# EAGLE board BFMC_Powerboard v0.2 (EAGLE 9.6.2), part 1 of 2
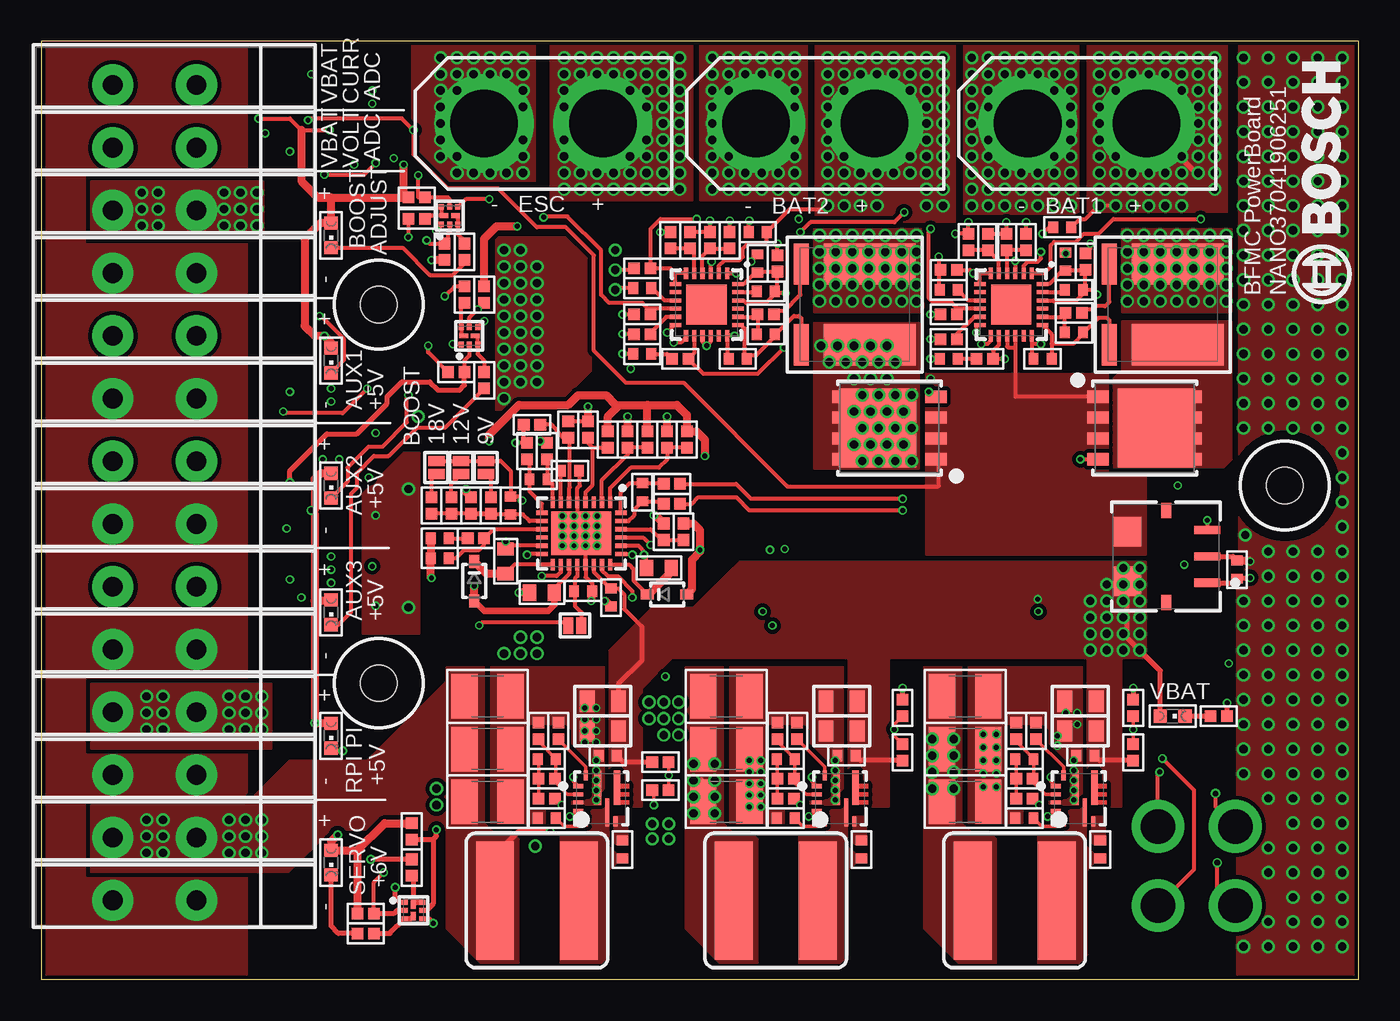
[diagram p3: board, top side]
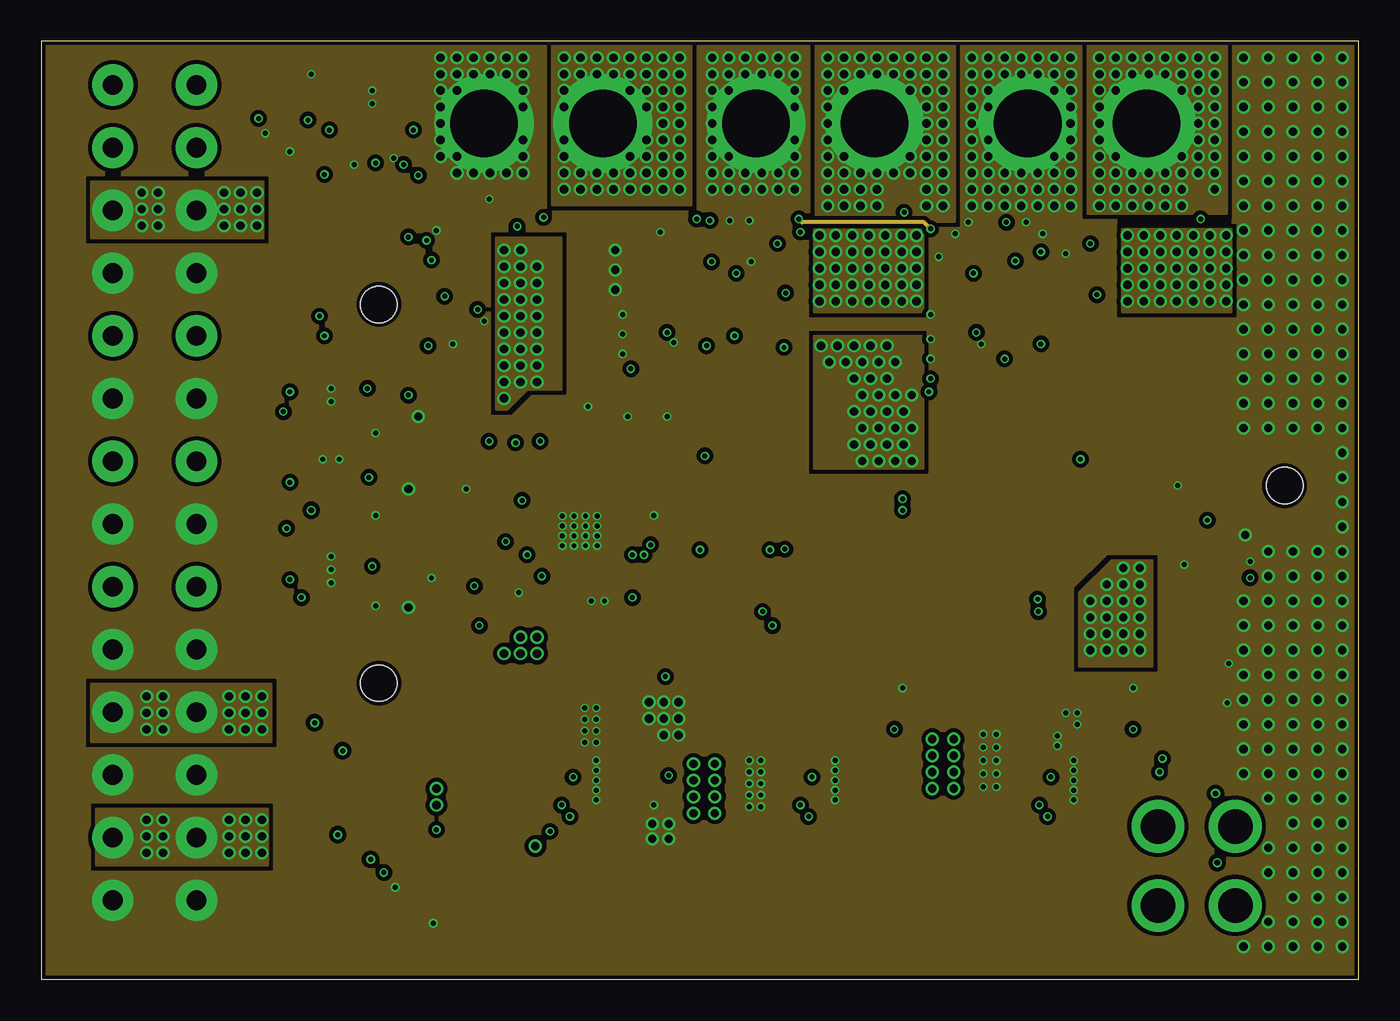
[diagram p4: board, inner layer Route2]
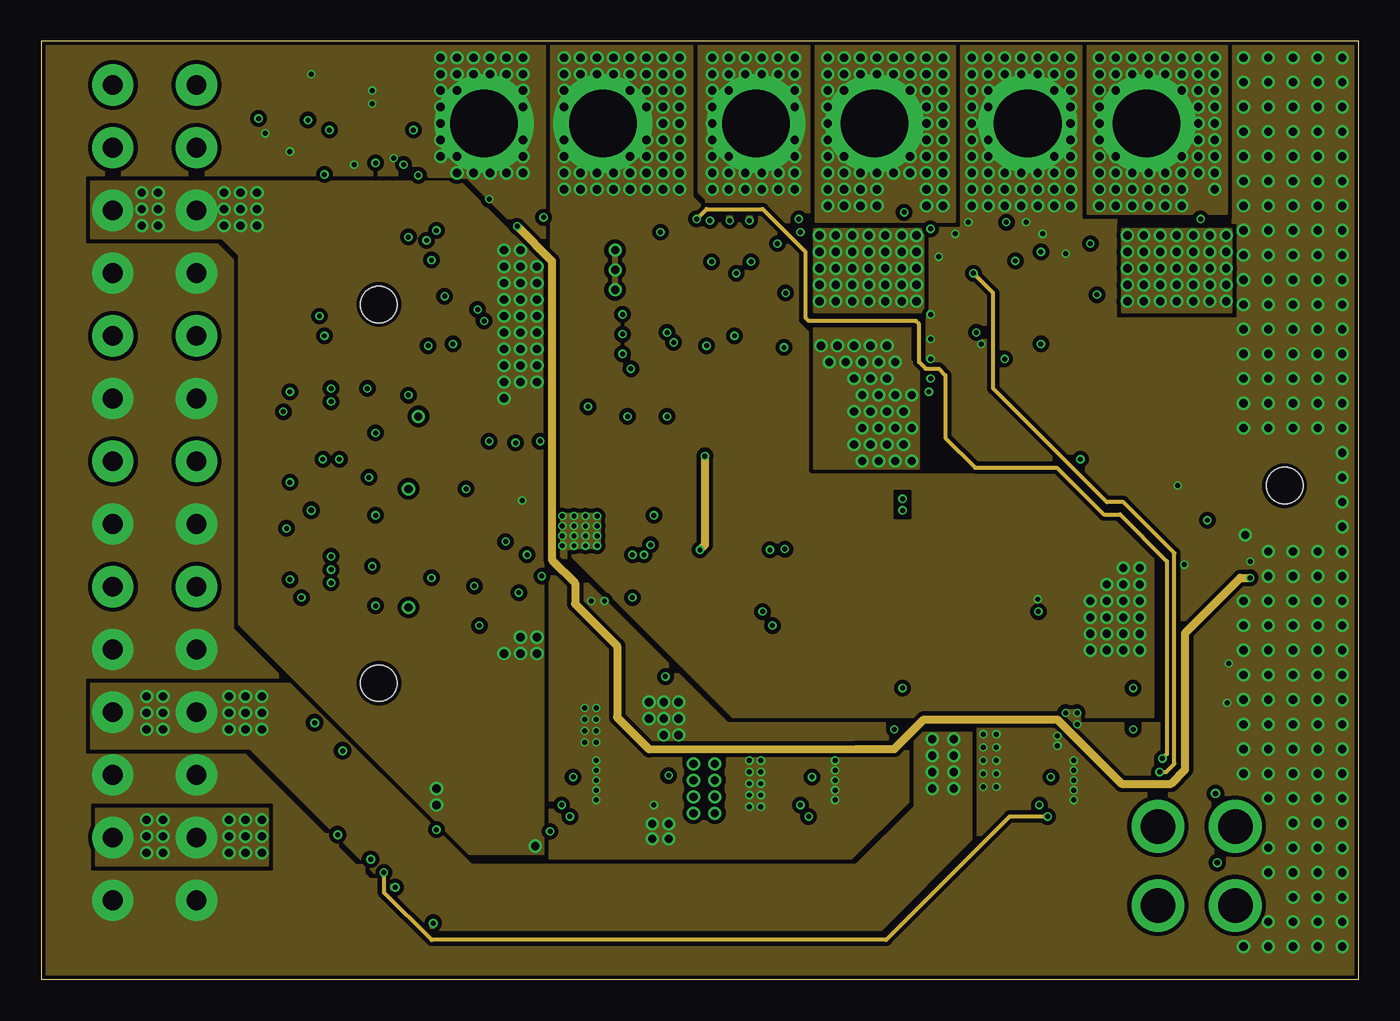
[diagram p5: board, inner layer Route3]
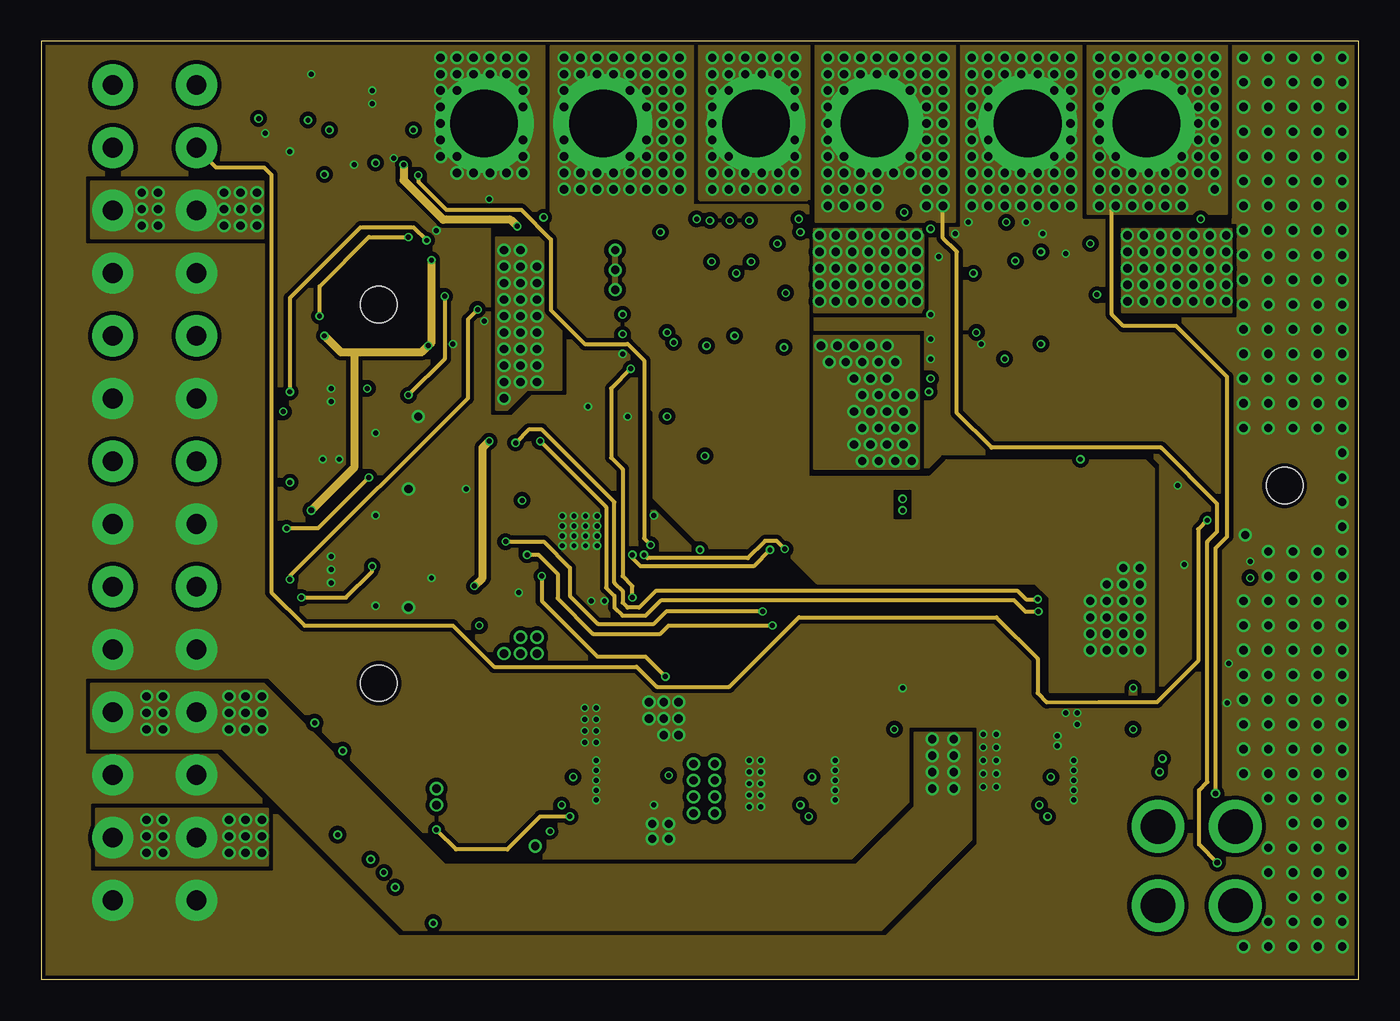
[diagram p6: board, inner layer Route14]
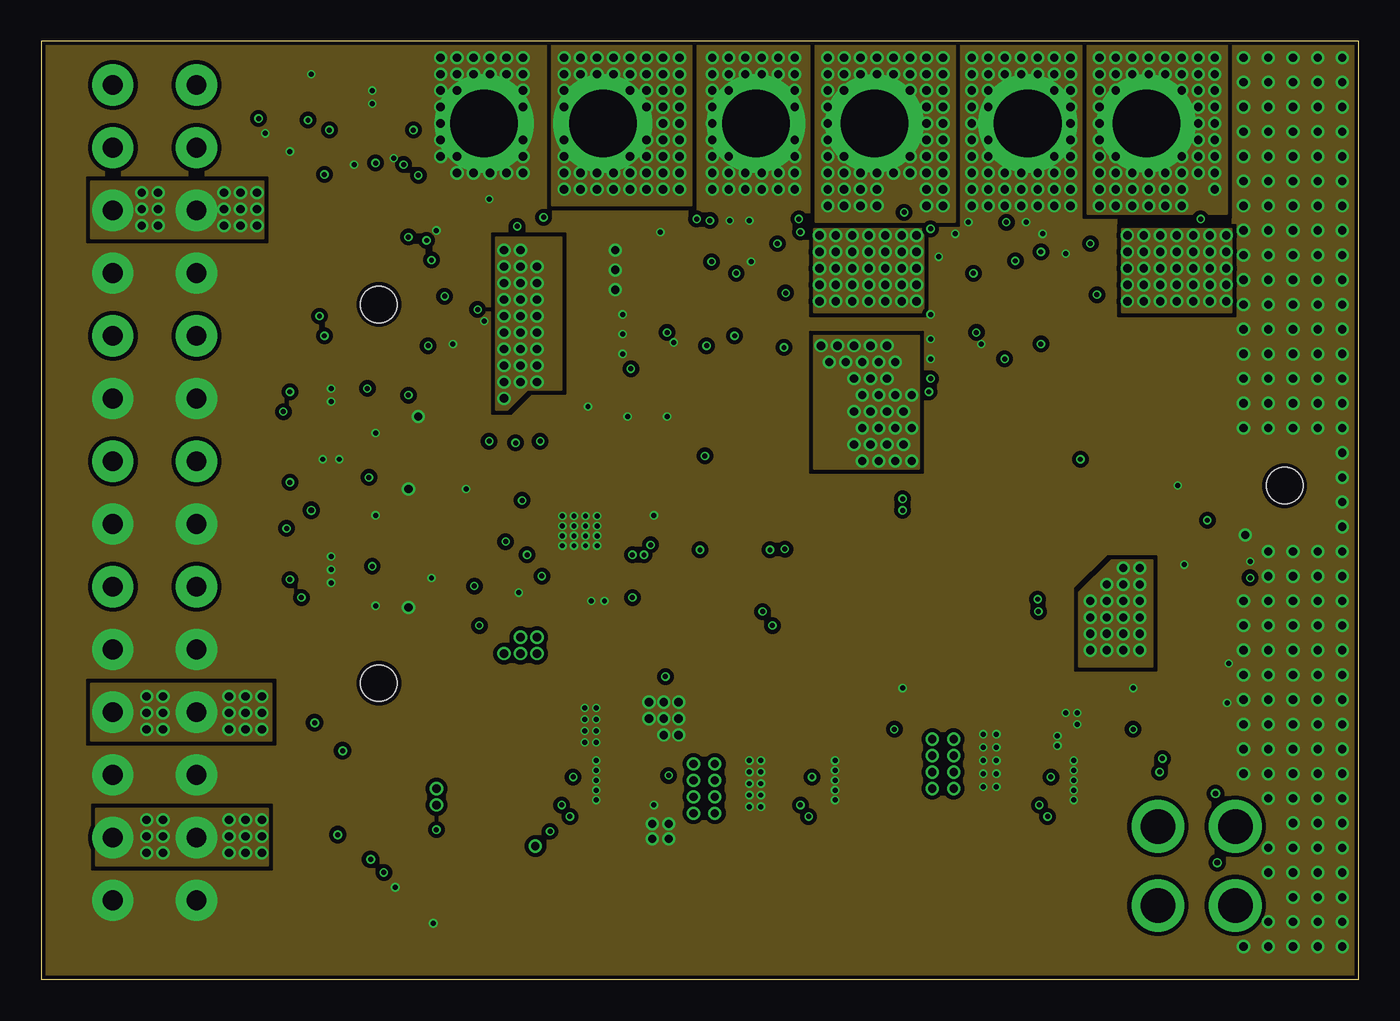
[diagram p7: board, inner layer Route15]
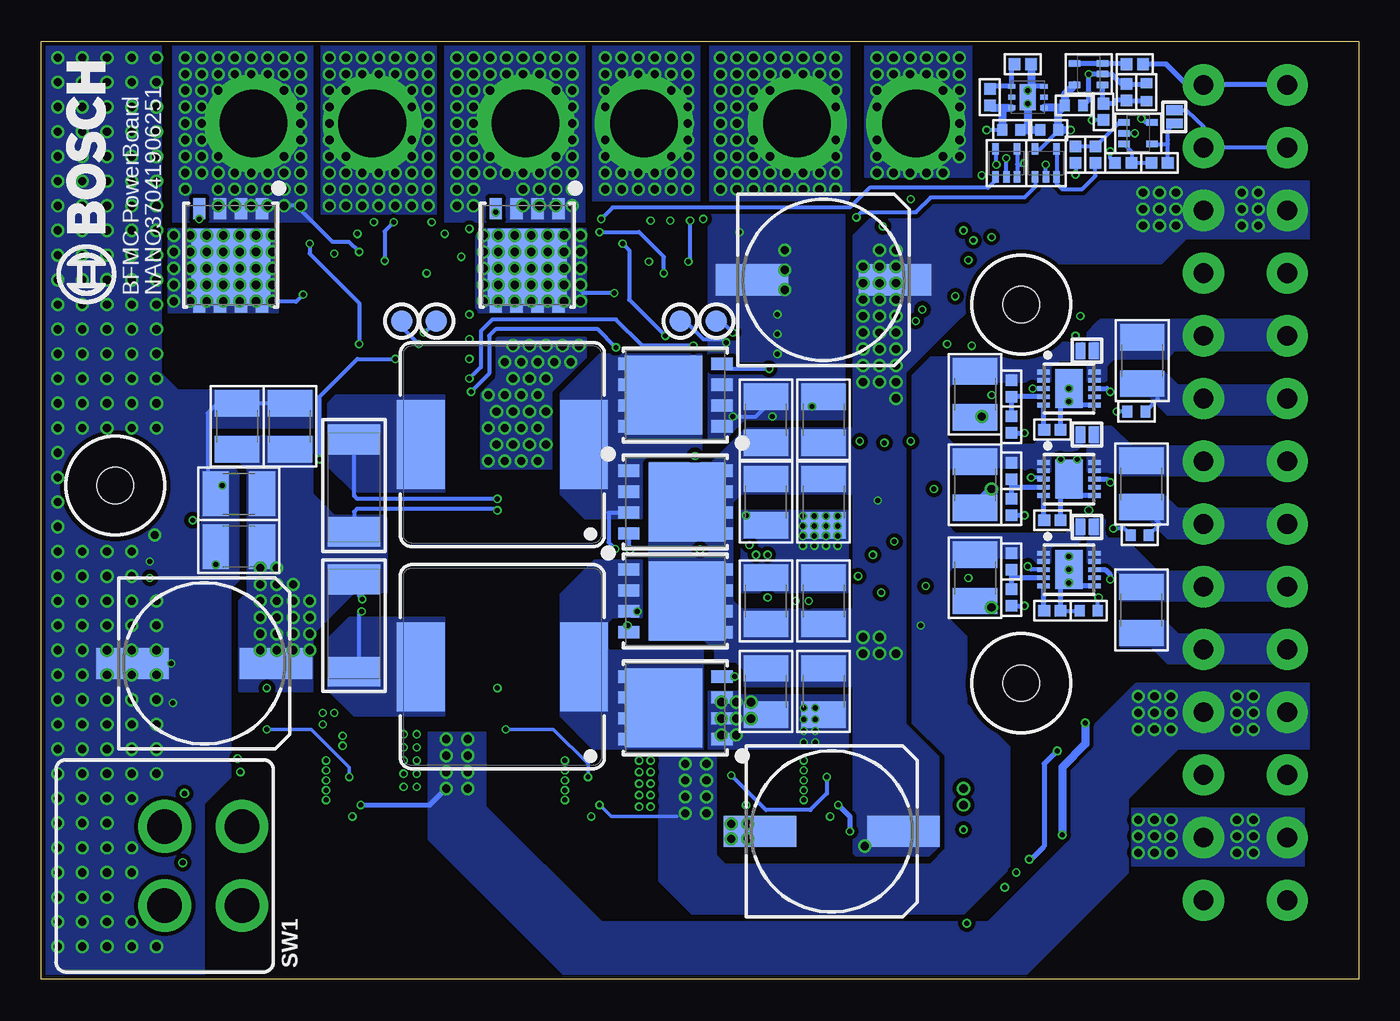
[diagram p8: board, bottom side, seen from below]

Size 80 x 57 mm. Coordinates in mm from the lower left corner, seen from the top.
Outline: 0,0 80,0 80,57 0,57 0,0
Copper layers (1+2*3+14*15+16): Top 0.018mm / dielectric 0.2mm / Route2 0.035mm / dielectric 0.36mm / Route3 0.035mm / dielectric 0.3mm / Route14 0.035mm / dielectric 0.15mm / Route15 0.035mm / dielectric 0.2mm / Bottom 0.018mm
Design rules "Multi-CB_6L_100µm-Tracks_OL35µm-IL35µm *": minimum track width 0.1mm, minimum drill 0.2mm, track to track 0.1mm, track to pad 0.1mm, pad to pad 0.1mm, via to via 0.1mm, smd to smd 0mil, copper to edge 0.2mm, drill to drill 0.2mm, minimum pad ring 0.125mm, minimum via ring 0.1mm, stop-mask expansion 2mil, vias tented up to drill 0.5mm, thermal gap 0.2mm
Holes 2.2 mm at 20.5,41 20.5,18 75.5,30
tRestrict: area 72.5,27 to 78.5,33
bRestrict: area 72.5,27 to 78.5,33; area 17.5,38 to 23.5,44; area 17.5,15 to 23.5,21

## Footprints (pad centres in the part's own frame; a part is rotated, then mirrored left to right if it is on the bottom)
C1210 = smd 1.6 x 2.7: 1 -1.4,0; 2 1.4,0
CAP_POL_1010 = smd 4.4 x 1.9: 1 -4.35,0; 2 4.35,0
C0603 = smd 0.8 x 1: 1 -0.75,0; 2 0.75,0
C0402_IPC = smd 0.6 x 0.7: 1 -0.55,0; 2 0.55,0
C0805 = smd 0.9 x 1.3: 1 -0.95,0; 2 0.95,0
SOD323-R = smd 0.8 x 0.6: A 1.2,0; C -1.2,0
DFN10-3X3 = smd 0.3 x 0.85: 1 -1,-1.55; 2 -0.5,-1.55; 3 0,-1.55; 4 0.5,-1.55; 5 1,-1.55; 6 1,1.55; 7 0.5,1.55; 8 0,1.55; 9 -0.5,1.55; 10 -1,1.55 | smd 2.38 x 1.65: EP 0,0
UFD-QFN28-4X5MM = smd 0.25 x 0.7: 1 -1.75,-1.9; 2 -1.25,-1.9; 3 -0.75,-1.9; 4 -0.25,-1.9; 5 0.25,-1.9; 6 0.75,-1.9; 7 1.25,-1.9; 8 1.75,-1.9; 15 1.75,1.9; 16 1.25,1.9; 17 0.75,1.9; 18 0.25,1.9; 19 -0.25,1.9; 20 -0.75,1.9; 21 -1.25,1.9; 22 -1.75,1.9 | smd 0.7 x 0.25: 9 2.4,-1.25; 10 2.4,-0.75; 11 2.4,-0.25; 12 2.4,0.25; 13 2.4,0.75; 14 2.4,1.25; 23 -2.4,1.25; 24 -2.4,0.75; 25 -2.4,0.25; 26 -2.4,-0.25; 27 -2.4,-0.75; 28 -2.4,-1.25 | smd 3.65 x 2.65: PAD 0,0
QFN24-4X4 = smd 0.7 x 0.25: 1 -1.9,1.25; 2 -1.9,0.75; 3 -1.9,0.25; 4 -1.9,-0.25; 5 -1.9,-0.75; 6 -1.9,-1.25; 13 1.9,-1.25; 14 1.9,-0.75; 15 1.9,-0.25; 16 1.9,0.25; 17 1.9,0.75; 18 1.9,1.25 | smd 0.25 x 0.7: 7 -1.25,-1.9; 8 -0.75,-1.9; 9 -0.25,-1.9; 10 0.25,-1.9; 11 0.75,-1.9; 12 1.25,-1.9; 19 1.25,1.9; 20 0.75,1.9; 21 0.25,1.9; 22 -0.25,1.9; 23 -0.75,1.9; 24 -1.25,1.9 | smd 2.45 x 2.45: PAD 0,0
SC70-5 = smd 0.4 x 0.7: 1 -0.65,-0.85; 2 0,-0.85; 3 0.65,-0.85; 4 0.65,0.85; 5 -0.65,0.85
ACS72981 = smd 0.5 x 1.6: 1 -1.6,-2.5; 2 0,-2.5; 3 1.6,-2.5 | smd 0.9 x 0.6: 4 2.8,0; 7 -2.8,0 | smd 1.8 x 1.7: 5 1.5,2.35; 6 -1.5,2.35
VQFN-HR-RPA = smd 0.6 x 0.25: 1 -1.4,0.75; 2 -1.4,0.25; 3 -1.4,-0.25; 4 -1.4,-0.75 | smd 0.25 x 0.6: 5 -0.93,-1.4; 7 0.87,-1.4; 10 -0.93,1.4 | smd 0.25 x 1.7: 6 0.37,-0.85 | smd 0.4 x 2.1: 8 0.95,0.65; 9 -0.21,0.65
WSON6_2X2MM_NO_SILK = smd 0.45 x 0.3: 1 -0.975,0.65; 2 -0.975,0; 3 -0.975,-0.65; 4 0.975,-0.65; 5 0.975,0; 6 0.975,0.65 | smd 1 x 1.6: EP 0,0
7447709003 = smd 2.9 x 5.4: 1 -4.95,0; 2 4.95,0
EXLA1V0705 = smd 2.3 x 7.2: 1 -2.55,0; 2 2.55,0
CHIPLED_0603 = smd 0.8 x 0.8: A 0,-0.75; C 0,0.75
PG-TDSON-8 = smd 1.3 x 0.75: 1 -2.825,1.905; 2 -2.825,0.635; 3 -2.825,-0.635; 4 -2.825,-1.905; 5 2.825,-1.905; 6 2.825,-0.635; 7 2.825,0.635; 8 2.825,1.905 | smd 4.7 x 4.8: TH 0.725,0
DFN1412-6 = smd 0.3 x 0.35: 1 -0.5,-0.53; 2 0,-0.53; 3 0.5,-0.53; 4 0.5,0.53; 5 0,0.53; 6 -0.5,0.53 | smd 0.53 x 0.3: 7 -0.35,0; 8 0.35,0
R0402_IPC = smd 0.7 x 0.7: 1 -0.5,0; 2 0.5,0
CRS272 = smd 2.5 x 5.6: 1A -2.45,0; 2A 2.45,0 | smd 2.5 x 0.9: 1B -2.45,-4.15; 2B 2.45,-4.15
R2512 = smd 1.8 x 3.2: 1 -2.8,0; 2 2.8,0
SJ_1X1.5_NO = smd 0.6 x 1: 1 -0.4,0; 2 0.4,0
M2021BB1W01 = drill 2.1 pad 3.2: 2 -2.4,0; 3 -2.4,4.7; 5 2.4,0; 6 2.4,4.7
TP13R = smd 1.3 x 1.3: TP 0,0
XT60PB = drill 4.1 pad 6: NEG -3.6,0; POS 3.6,0
1704994 = drill 1.2 pad 2.5: 1 0,-5.08; 2 0,0

## Placement (x,y rotation side)
C1  22uF  [C1210]  23.3,35.55 270 bottom
C2  22uF  [C1210]  68,26.3 180 bottom
C3  22uF  [C1210]  68.1,33.6 90 bottom
C4  22uF  [C1210]  68,29.5 180 bottom
C5  22uF  [C1210]  64.9,33.6 90 bottom
C6  22uF  [C1210]  36,29 270 bottom
C7  22uF  [C1210]  32.5,29 270 bottom
C8  22uF  [C1210]  36,34 90 bottom
C9  22uF  [C1210]  32.5,34 90 bottom
C10  22uF  [C1210]  36,17.5 270 bottom
C11  22uF  [C1210]  32.5,17.5 270 bottom
C12  22uF  [C1210]  32.5,23 90 bottom
C13  22uF  [C1210]  36,23 90 bottom
C14  220uF  [CAP_POL_1010]  70.1,19.2 0 bottom
C15  220uF  [CAP_POL_1010]  32.5,42.5 0 bottom
C16  220uF  [CAP_POL_1010]  32,9 0 bottom
C17  100nF  [C0603]  28.2,25.4 270 top
C18  100nF  [C0603]  37.5,25 180 top
C19  100nF  [C0402_IPC]  43.5,45.4 180 top
C20  4.7uF  [C0603]  30.4,23.5 180 top
C21  100nF  [C0402_IPC]  44,41.8 180 top
C22  100nF  [C0402_IPC]  16.4,22.4 180 bottom
C23  100nF  [C0402_IPC]  13.3,27 0 bottom
C24  100nF  [C0402_IPC]  72.6,24.9 90 top
C25  100nF  [C0402_IPC]  64.3,7.9 90 top
C26  10uF  [C0805]  63.1,15.1 180 top
C27  100nF  [C0402_IPC]  63.4,13.6 180 top
C28  10uF  [C0805]  63.1,16.9 180 top
C29  150pF  [C0402_IPC]  59.7,13.4 0 top
C30  100nF  [C0402_IPC]  32.1,30.9 0 top
C31  22uF  [C1210]  56.1,10.8 0 top
C32  22uF  [C1210]  56.1,14 0 top
C33  22uF  [C1210]  56.1,17.2 0 top
C34  47nF  [C0402_IPC]  59.7,9.8 180 top
C35  100nF  [C0402_IPC]  62,45.7 180 top
C36  100nF  [C0402_IPC]  62.7,41.9 180 top
C37  100nF  [C0402_IPC]  62.2,43.6 90 top
C38  10nF  [C0402_IPC]  62.7,39.3 0 top
C39  10nF  [C0402_IPC]  60.8,37.7 0 top
C40  TBD  [C0402_IPC]  55.1,37.7 0 top
C41  100nF  [C0402_IPC]  43.5,43.5 90 top
C42  33nF  [C0402_IPC]  55.1,41.9 180 top
C43  10nF  [C0402_IPC]  44,39.2 0 top
C44  10nF  [C0402_IPC]  42.3,37.7 0 top
C45  TBD  [C0402_IPC]  36.5,38 0 top
C46  33nF  [C0402_IPC]  36.5,42 180 top
C47  100nF  [C0402_IPC]  13.5,34.5 0 bottom
C53  100nF  [C0402_IPC]  34.6,23.2 270 top
C54  100nF  [C0402_IPC]  32.9,23.6 0 top
C55  15nF  [C0402_IPC]  24.2,26.8 180 top
C56  100pF  [C0402_IPC]  24.2,25.6 180 top
C57  DNM  [C0402_IPC]  28.5,28.8 270 top
C58  1nF  [C0402_IPC]  36.5,29.6 270 top
C59  1nF  [C0402_IPC]  30.2,30.4 180 top
C60  22uF  [C1210]  13.15,37.6 270 bottom
C61  22uF  [C1210]  23.3,30.05 270 bottom
C62  22uF  [C1210]  13.2,30.1 270 bottom
C63  22uF  [C1210]  23.3,24.4 270 bottom
C64  22uF  [C1210]  13.2,22.45 270 bottom
C65  100nF  [C0402_IPC]  21.1,51.6 0 bottom
C66  100nF  [C0402_IPC]  18.8,51.6 180 bottom
C67  15nF  [C0402_IPC]  12.9,53.9 90 bottom
C68  100nF  [C0402_IPC]  17.3,53.1 0 bottom
C78  100nF  [C0402_IPC]  49.8,7.9 90 top
C79  10uF  [C0805]  48.6,15.1 180 top
C80  100nF  [C0402_IPC]  48.9,13.6 180 top
C81  10uF  [C0805]  48.6,16.9 180 top
C82  150pF  [C0402_IPC]  45.2,13.4 0 top
C83  22uF  [C1210]  41.6,10.8 0 top
C84  22uF  [C1210]  41.6,14 0 top
C85  22uF  [C1210]  41.6,17.2 0 top
C86  47nF  [C0402_IPC]  45.2,9.8 180 top
C96  100nF  [C0402_IPC]  35.3,7.9 90 top
C97  10uF  [C0805]  34.1,15.1 180 top
C98  100nF  [C0402_IPC]  34.4,13.6 180 top
C99  10uF  [C0805]  34.1,16.9 180 top
C100  150pF  [C0402_IPC]  30.7,13.4 0 top
C101  22uF  [C1210]  27.1,10.8 0 top
C102  22uF  [C1210]  27.1,14 0 top
C103  22uF  [C1210]  27.1,17.2 0 top
C104  47nF  [C0402_IPC]  30.7,9.8 180 top
D1  BAS140W  [SOD323-R]  26.3,24.2 270 top
D2  BAS140W  [SOD323-R]  38,23.4 0 top
IC1  SIP32434  [DFN10-3X3]  17.6,35.9 270 bottom
IC2  LTC3787  [UFD-QFN28-4X5MM]  32.8,27.1 180 top
IC3  LM74900Q  [QFN24-4X4]  40.4,41 270 top
IC4  TLV9001IDCKR  [SC70-5]  13.4,51.4 270 bottom
IC5  ACS72981LLRATR-100U3  [ACS72981]  68.3,25.7 90 top
IC6  SIP32434  [DFN10-3X3]  17.6,30.4 270 bottom
IC7  TPS56A37  [VQFN-HR-RPA]  63,11 0 top
IC8  LM74900Q  [QFN24-4X4]  58.9,41 270 top
IC9  TLV9001IDCKR  [SC70-5]  21.4,49.6 0 bottom
IC10  SIP32434  [DFN10-3X3]  17.6,24.9 270 bottom
IC11  TPS70933DRVR  [WSON6_2X2MM_NO_SILK]  20.1,53.6 180 bottom
IC12  TLV9001IDCKR  [SC70-5]  16.4,55 90 bottom
IC13  TLV9001IDCKR  [SC70-5]  19,49.6 0 bottom
IC14  TPS56A37  [VQFN-HR-RPA]  48.5,11 0 top
IC16  TPS56A37  [VQFN-HR-RPA]  34,11 0 top
L1  3.5uH  [7447709003]  52,32.5 180 bottom
L2  3.5uH  [7447709003]  52,19 180 bottom
L3  3.3uH  [EXLA1V0705]  59.1,4.8 180 top
L7  3.3uH  [EXLA1V0705]  44.6,4.8 180 top
L9  3.3uH  [EXLA1V0705]  30.1,4.8 180 top
LED1  YELLOW  [CHIPLED_0603]  17.6,45.2 180 top
LED2  YELLOW  [CHIPLED_0603]  17.6,14.8 180 top
LED3  YELLOW  [CHIPLED_0603]  68.7,16 270 top
LED4  YELLOW  [CHIPLED_0603]  17.6,7.1 180 top
LED5  YELLOW  [CHIPLED_0603]  17.6,37.6 180 top
LED6  YELLOW  [CHIPLED_0603]  17.6,30 180 top
LED7  YELLOW  [CHIPLED_0603]  17.6,22.3 180 top
Q1  IAUC100N04S6N028  [PG-TDSON-8]  41.5,29 0 bottom
Q2  IAUC100N04S6N028  [PG-TDSON-8]  68.5,44 270 bottom
Q3  IAUC100N04S6N028  [PG-TDSON-8]  67,33.5 0 top
Q4  IAUC100N04S6N028  [PG-TDSON-8]  50.5,44 270 bottom
Q5  IAUC100N04S6N028  [PG-TDSON-8]  51.5,33.5 180 top
Q6  IAUC100N04S6N028  [PG-TDSON-8]  41.5,35.5 180 bottom
Q7  IAUC100N04S6N028  [PG-TDSON-8]  41.5,23 0 bottom
Q8  IAUC100N04S6N028  [PG-TDSON-8]  41.5,16.5 180 bottom
Q9  2N7002AKRA  [DFN1412-6]  26,39.1 0 top
Q10  2N7002AKRA  [DFN1412-6]  22.6,4.2 270 top
Q11  2N7002AKRA  [DFN1412-6]  24.8,46.4 0 top
R1  10k  [R0402_IPC]  21.1,30.9 90 bottom
R2  0.001R  [CRS272]  69,41 270 top
R3  10k  [R0402_IPC]  21.1,35.9 90 bottom
R4  DNM  [R0402_IPC]  21.1,33.7 90 bottom
R5  8.87k  [R0402_IPC]  55.1,38.9 0 top
R6  0.004R  [R2512]  61,30 270 bottom
R7  0.004R  [R2512]  61,21.5 90 bottom
R8  0R  [R0402_IPC]  38,32.8 270 top
R9  DNM  [R0402_IPC]  39.2,32.8 90 top
R10  10k  [R0402_IPC]  35.6,32.8 270 top
R11  10k  [R0402_IPC]  36.8,32.8 90 top
R12  10k  [R0402_IPC]  33.2,33.4 270 top
R13  10k  [R0402_IPC]  34.4,32.8 90 top
R14  10k  [R0402_IPC]  32,33.4 270 top
R15  30k  [R0402_IPC]  29.8,33.7 180 top
R16  DNM  [R0402_IPC]  39,27.2 90 top
R17  TBD  [R0402_IPC]  17.2,50.1 90 bottom
R18  0R  [R0402_IPC]  37.8,27.2 270 top
R19  TBD  [R0402_IPC]  38.8,37.7 0 top
R20  100k  [R0402_IPC]  40.6,44.9 90 top
R21  100k  [R0402_IPC]  39.4,44.9 90 top
R22  10k  [R0402_IPC]  26.1,28.8 270 top
R23  10k  [R0402_IPC]  26.4,26.8 0 top
R24  140k  [R0402_IPC]  23.7,28.8 270 top
R25  90.9k  [R0402_IPC]  24.9,28.8 90 top
R26  64.9k  [R0402_IPC]  27.3,28.8 90 top
R27  10R  [R0402_IPC]  38.3,28.9 0 top
R28  10R  [R0402_IPC]  38.3,30.1 0 top
R29  10k  [R0402_IPC]  36.5,43.2 0 top
R30  0.001R  [CRS272]  50.3,41 270 top
R31  TBD  [R0402_IPC]  16,50.1 90 bottom
R32  TBD  [R0402_IPC]  12.1,49.6 0 bottom
R33  TBD  [R0402_IPC]  14.3,49.6 0 bottom
R37  30k  [R0402_IPC]  66.3,16.5 270 top
R38  100k  [R0402_IPC]  66.3,13.8 270 top
R39  52.3k  [R0402_IPC]  60.4,15.1 270 top
R40  10k  [R0402_IPC]  59.2,15.1 270 top
R41  73.2k  [R0402_IPC]  59.7,12.2 180 top
R42  49.9R  [R0402_IPC]  59.7,11 0 top
R43  90.9k  [R0402_IPC]  30.7,12.2 180 top
R44  5.1k  [R0402_IPC]  63.4,43.6 270 top
R45  49.9R  [R0402_IPC]  62.7,40.5 0 top
R46  TBD  [R0402_IPC]  57.3,37.7 0 top
R47  100k  [R0402_IPC]  57.5,44.8 90 top
R48  4.53k  [R0402_IPC]  56.3,44.8 270 top
R49  1k  [R0402_IPC]  55.1,40.4 0 top
R50  49.9R  [R0402_IPC]  44,40.4 0 top
R51  5.1k  [R0402_IPC]  44.7,43.5 270 top
R52  8.87k  [R0402_IPC]  59.8,44.8 270 top
R53  10R  [R0402_IPC]  30.7,32.1 270 top
R54  100k  [R0402_IPC]  58.6,44.8 90 top
R55  10k  [R0402_IPC]  55.1,43.1 0 top
R56  10R  [R0402_IPC]  29.5,32.1 270 top
R57  10k  [R0402_IPC]  22.8,47.5 180 top
R58  5.1k  [R0402_IPC]  25.7,44.2 270 top
R59  10k  [R0402_IPC]  19.7,4 180 top
R60  5.1k  [R0402_IPC]  22.5,6.8 90 top
R61  100k  [R0402_IPC]  15.5,52.7 270 bottom
R62  30k  [R0402_IPC]  14.1,53.9 270 bottom
R63  10k  [R0402_IPC]  22.5,9 90 top
R64  5.1k  [R0402_IPC]  19.7,2.8 180 top
R65  12.1k  [R0402_IPC]  18.6,33.4 180 bottom
R66  DNM  [R0402_IPC]  21.1,28.7 90 bottom
R67  12.1k  [R0402_IPC]  18.6,27.9 180 bottom
R68  10k  [R0402_IPC]  21.1,25.4 90 bottom
R69  DNM  [R0402_IPC]  21.1,23.2 90 bottom
R70  12.1k  [R0402_IPC]  18.6,22.4 180 bottom
R71  10k  [R0402_IPC]  24.5,44.2 270 top
R72  5.1k  [R0402_IPC]  22.8,46.2 180 top
R73  10k  [R0402_IPC]  25.2,36.9 180 top
R74  5.1k  [R0402_IPC]  25.7,41.6 90 top
R75  10k  [R0402_IPC]  26.9,41.6 90 top
R76  5.1k  [R0402_IPC]  26.9,36.4 270 top
R77  10k  [R0402_IPC]  20.4,55.6 180 bottom
R78  30k  [R0402_IPC]  22.4,53.6 270 bottom
R79  1k  [R0402_IPC]  13.6,55.6 0 bottom
R80  10k  [R0402_IPC]  71.5,16 180 top
R81  1k  [R0402_IPC]  36.5,40.4 0 top
R82  8.87k  [R0402_IPC]  41.8,44.9 270 top
R83  4.53k  [R0402_IPC]  38.2,44.9 270 top
R84  8.87k  [R0402_IPC]  36.5,39.2 0 top
R87  30k  [R0402_IPC]  52.3,16.5 270 top
R88  100k  [R0402_IPC]  52.3,13.8 270 top
R89  52.3k  [R0402_IPC]  45.9,15.1 270 top
R90  10k  [R0402_IPC]  44.7,15.1 270 top
R91  73.2k  [R0402_IPC]  45.2,12.2 180 top
R92  49.9R  [R0402_IPC]  45.2,11 0 top
R99  30k  [R0402_IPC]  37.6,11.5 0 top
R100  100k  [R0402_IPC]  37.6,13.2 180 top
R101  52.3k  [R0402_IPC]  31.4,15.1 270 top
R102  10k  [R0402_IPC]  30.2,15.1 270 top
R104  49.9R  [R0402_IPC]  30.7,11 0 top
SJ1  NO  [SJ_1X1.5_NO]  32.4,21.5 0 top
SJ2  NO  [SJ_1X1.5_NO]  27,31.1 90 top
SJ3  NO  [SJ_1X1.5_NO]  25.5,31.1 90 top
SJ4  NC  [SJ_1X1.5_NO]  24,31.1 90 top
SJ5  NO  [SJ_1X1.5_NO]  11.2,52.4 270 bottom
SJ6  NO  [SJ_1X1.5_NO]  16.5,38.2 180 bottom
SJ7  NO  [SJ_1X1.5_NO]  16.5,33.1 180 bottom
SJ8  NO  [SJ_1X1.5_NO]  16.5,27.5 180 bottom
SW1  M2021BB1W01  [M2021BB1W01]  72.5,6.9 270 bottom
TP1  TPTP13R  [TP13R]  56,40 270 bottom
TP2  TPTP13R  [TP13R]  39,40 180 bottom
TP3  TPTP13R  [TP13R]  41.2,40 0 bottom
TP4  TPTP13R  [TP13R]  58.1,40 0 bottom
U$1  [BOSCH_15]  79.6,40.95 90 top
U$2  [BOSCH_15]  75.4,40.95 90 bottom
X1  XT60PB-M  [XT60PB]  63.5,52 0 top
X2  XT60PB-M  [XT60PB]  47,52 0 top
X3  XT60PB-F  [XT60PB]  30.5,52 0 top
X4  ZFKDSA1-W-6,35  [1704994]  9.43,54.34 270 top
X5  ZFKDSA1-W-6,35  [1704994]  9.43,50.53 270 top
X6  ZFKDSA1-W-6,35  [1704994]  9.43,46.72 270 top
X7  ZFKDSA1-W-6,35  [1704994]  9.43,42.91 270 top
X8  ZFKDSA1-W-6,35  [1704994]  9.43,39.1 270 top
X9  ZFKDSA1-W-6,35  [1704994]  9.43,35.29 270 top
X10  ZFKDSA1-W-6,35  [1704994]  9.43,31.48 270 top
X11  ZFKDSA1-W-6,35  [1704994]  9.43,27.67 270 top
X12  ZFKDSA1-W-6,35  [1704994]  9.43,23.86 270 top
X13  ZFKDSA1-W-6,35  [1704994]  9.43,20.05 270 top
X14  ZFKDSA1-W-6,35  [1704994]  9.43,16.24 270 top
X15  ZFKDSA1-W-6,35  [1704994]  9.43,12.43 270 top
X16  ZFKDSA1-W-6,35  [1704994]  9.43,8.62 270 top
X17  ZFKDSA1-W-6,35  [1704994]  9.43,4.81 270 top